# Altium project Twintig-Tap-Pads.PrjPcb
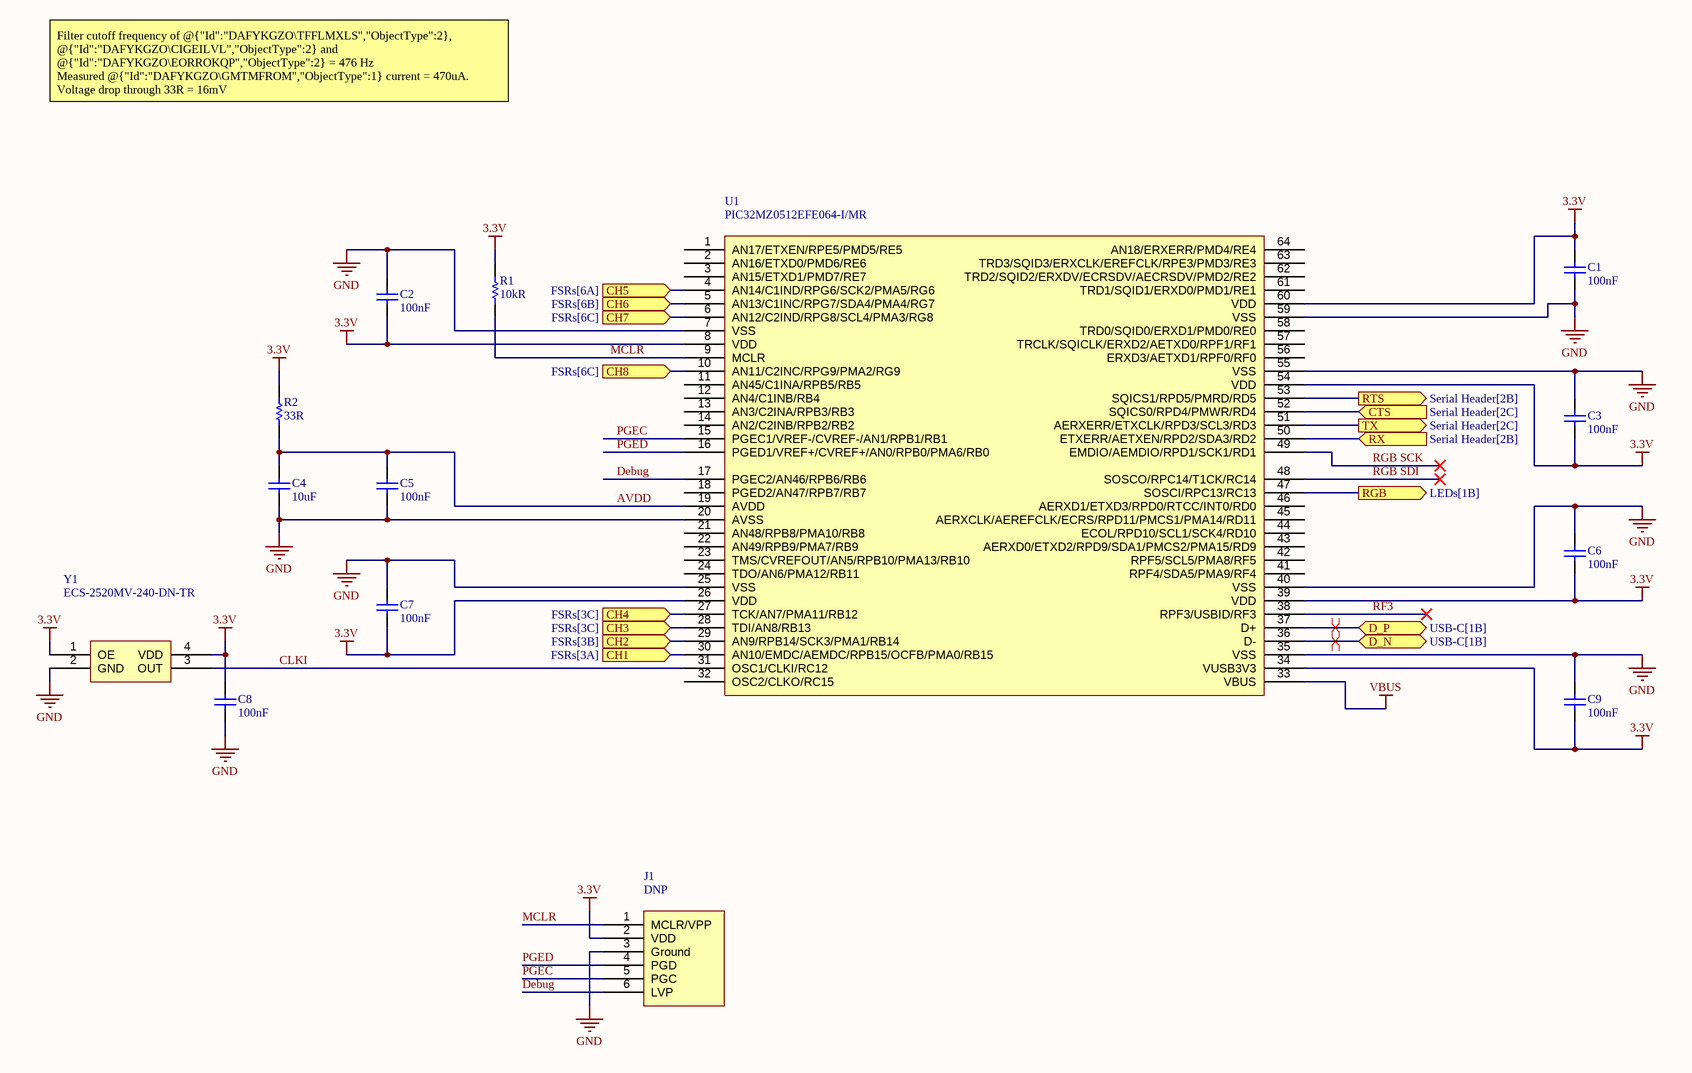
[diagram p0: PIC32MZ.SchDoc]
Version: v1.0.1; Project: Twintig Tap Pads; Author: Seb Madgwick
6 sheets, 70 parts. Net scope: flat (ports and power ports of the same name join across sheets).
Board file: Twintig-Tap-Pads.PcbDoc
Sheets:
  PIC32MZ.SchDoc
  USB-C.SchDoc
  Serial Header.SchDoc
  Voltage Regulator.SchDoc
  FSRs.SchDoc
  LEDs.SchDoc

## Sheet PIC32MZ.SchDoc
size A3; SheetNumber: 1; SheetTotal: 6

### Parts
C1  100nF  [Capacitor 0402]
C2  100nF  [Capacitor 0402]
C3  100nF  [Capacitor 0402]
C4  10uF  [Capacitor 0402]
C5  100nF  [Capacitor 0402]
C6  100nF  [Capacitor 0402]
C7  100nF  [Capacitor 0402]
C8  100nF  [Capacitor 0402]
C9  100nF  [Capacitor 0402]
J1  DNP  [Tag Connect No Legs]
R1  10kR  [Resistor 0402]
R2  33R  [Resistor 0402]
U1  PIC32MZ0512EFE064-I/MR  [QFN-64]
Y1  ECS-2520MV-240-DN-TR  [ECS 2x2.5mm]

### Ports
CH1 (in, see FSRs[3A]), CH2 (in, see FSRs[3B]), CH3 (in, see FSRs[3C]), CH4 (in, see FSRs[3C]), CH5 (in, see FSRs[6A]), CH6 (in, see FSRs[6B]), CH7 (in, see FSRs[6C]), CH8 (in, see FSRs[6C]), CTS (in, see Serial Header[2C]), D_N (bidir, see USB-C[1B]), D_P (bidir, see USB-C[1B]), RGB (out, see LEDs[1B]), RTS (out, see Serial Header[2B]), RX (in, see Serial Header[2B]), TX (out, see Serial Header[2C])

### Nets
3.3V: C1.2 C2.1 C3.1 C6.1 C7.1 C8.2 C9.1 J1.2(VDD) R1.2 R2.2 U1.8(VDD) U1.26(VDD) U1.34(VUSB3V3) U1.39(VDD) U1.54(VDD) U1.60(VDD) Y1.1(OE) Y1.4(VDD)
GND: C1.1 C2.2 C3.2 C4.1 C5.1 C6.2 C7.2 C8.1 C9.2 J1.3(Ground) U1.7(VSS) U1.20(AVSS) U1.25(VSS) U1.35(VSS) U1.40(VSS) U1.55(VSS) U1.59(VSS) Y1.2(GND)
VBUS: U1.33(VBUS)
AVDD: C4.2 C5.2 R2.1 U1.19(AVDD)
CH1: U1.30(AN10/EMDC/AEMDC/RPB15/OCFB/PMA0/RB15) ; port CH1
CH2: U1.29(AN9/RPB14/SCK3/PMA1/RB14) ; port CH2
CH3: U1.28(TDI/AN8/RB13) ; port CH3
CH4: U1.27(TCK/AN7/PMA11/RB12) ; port CH4
CH5: U1.4(AN14/C1IND/RPG6/SCK2/PMA5/RG6) ; port CH5
CH6: U1.5(AN13/C1INC/RPG7/SDA4/PMA4/RG7) ; port CH6
CH7: U1.6(AN12/C2IND/RPG8/SCL4/PMA3/RG8) ; port CH7
CH8: U1.10(AN11/C2INC/RPG9/PMA2/RG9) ; port CH8
CLKI: U1.31(OSC1/CLKI/RC12) Y1.3(OUT)
CTS: U1.52(SQICS0/RPD4/PMWR/RD4) ; port CTS
D_N: U1.36(D-) ; port D_N
D_P: U1.37(D+) ; port D_P
Debug: J1.6(LVP) U1.17(PGEC2/AN46/RPB6/RB6)
MCLR: J1.1(MCLR/VPP) R1.1 U1.9(MCLR)
PGEC: J1.5(PGC) U1.15(PGEC1/VREF-/CVREF-/AN1/RPB1/RB1)
PGED: J1.4(PGD) U1.16(PGED1/VREF+/CVREF+/AN0/RPB0/PMA6/RB0)
RF3: U1.38(RPF3/USBID/RF3)
RGB: U1.47(SOSCI/RPC13/RC13) ; port RGB
RGB SCK: U1.49(EMDIO/AEMDIO/RPD1/SCK1/RD1)
RGB SDI: U1.48(SOSCO/RPC14/T1CK/RC14)
RTS: U1.53(SQICS1/RPD5/PMRD/RD5) ; port RTS
RX: U1.50(ETXERR/AETXEN/RPD2/SDA3/RD2) ; port RX
TX: U1.51(AERXERR/ETXCLK/RPD3/SCL3/RD3) ; port TX

Not connected (* = marked no-connect by the designer): U1 1(AN17/ETXEN/RPE5/PMD5/RE5) 2(AN16/ETXD0/PMD6/RE6) 3(AN15/ETXD1/PMD7/RE7) 11(AN45/C1INA/RPB5/RB5) 12(AN4/C1INB/RB4) 13(AN3/C2INA/RPB3/RB3) 14(AN2/C2INB/RPB2/RB2) 18(PGED2/AN47/RPB7/RB7) 21(AN48/RPB8/PMA10/RB8) 22(AN49/RPB9/PMA7/RB9) 23(TMS/CVREFOUT/AN5/RPB10/PMA13/RB10) 24(TDO/AN6/PMA12/RB11) 32(OSC2/CLKO/RC15) 41(RPF4/SDA5/PMA9/RF4) 42(RPF5/SCL5/PMA8/RF5) 43(AERXD0/ETXD2/RPD9/SDA1/PMCS2/PMA15/RD9) 44(ECOL/RPD10/SCL1/SCK4/RD10) 45(AERXCLK/AEREFCLK/ECRS/RPD11/PMCS1/PMA14/RD11) 46(AERXD1/ETXD3/RPD0/RTCC/INT0/RD0) 56(ERXD3/AETXD1/RPF0/RF0) 57(TRCLK/SQICLK/ERXD2/AETXD0/RPF1/RF1) 58(TRD0/SQID0/ERXD1/PMD0/RE0) 61(TRD1/SQID1/ERXD0/PMD1/RE1) 62(TRD2/SQID2/ERXDV/ECRSDV/AECRSDV/PMD2/RE2) 63(TRD3/SQID3/ERXCLK/EREFCLK/RPE3/PMD3/RE3) 64(AN18/ERXERR/PMD4/RE4)

### Layout directives
differential pair: D_N, D_P

### Notes on the sheet
- Filter cutoff frequency of @{"Id":"DAFYKGZO\TFFLMXLS","ObjectType":2}, @{"Id":"DAFYKGZO\CIGEILVL","ObjectType":2} and @{"Id":"DAFYKGZO\EORROKQP","ObjectType":2} = 476 Hz
  Measured @{"Id":"DAFYKGZO\GMTMFROM","ObjectType":1} current = 470uA.  Voltage drop through 33R = 16mV
  @{"Id":"DAFYKGZO\FKAAGDIW","ObjectType":1} functionality may be compromised by USBID regardless of configuration.
  @{"Id":"DAFYKGZO\YGGPIFJJ","ObjectType":1} requires PIC32MZ internal pull-down to ensure @{"Id":"GGXARTPA\NNOJOWHS","ObjectType":1} is idle low.
  @{"Id":"DAFYKGZO\MQFSLGKT","ObjectType":1} will output SCK1 regardless of PPS configuration.
- TITLE
- SIZE
- A3
- VARIANT
- PROJECT
- SHEET
- VERSION
- OF
- AUTHOR
- DATE

### Library data of the parts
C1-C9 = Capacitor
J1 = MPLAB ICSP
R1 R2 = Resistor
U1 = PIC32MZ2048EFH064
Y1 = Oscillator

## Sheet USB-C.SchDoc
size A4; SheetNumber: 2; SheetTotal: 6
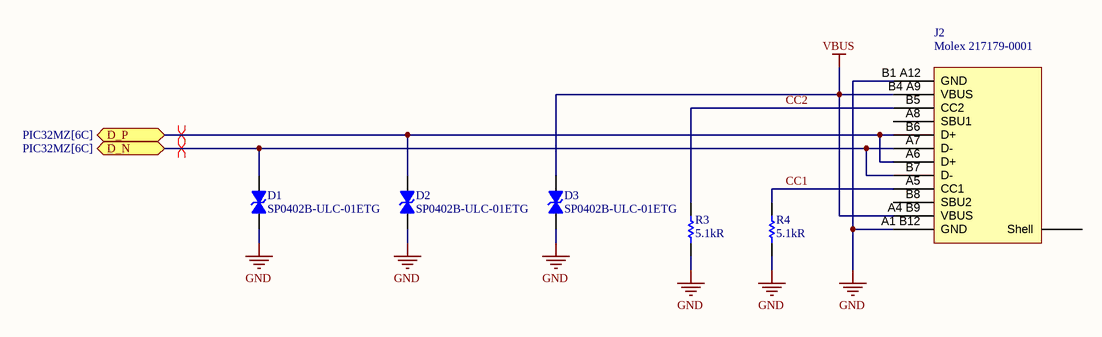
[diagram p1: USB-C.SchDoc]

### Parts
D1  SP0402B-ULC-01ETG  [Diode TVS 0402]
D2  SP0402B-ULC-01ETG  [Diode TVS 0402]
D3  SP0402B-ULC-01ETG  [Diode TVS 0402]
J2  Molex 217179-0001  [Molex 217179-0001]
R3  5.1kR  [Resistor 0402]
R4  5.1kR  [Resistor 0402]

### Ports
D_N (bidir, see PIC32MZ[6C]), D_P (bidir, see PIC32MZ[6C])

### Nets
GND: D1.2 D2.2 D3.2 J2.A1_B12(GND) J2.B1_A12(GND) R3.1 R4.1
VBUS: D3.1 J2.A4_B9(VBUS) J2.B4_A9(VBUS)
CC1: J2.A5(CC1) R4.2
CC2: J2.B5(CC2) R3.2
D_N: D1.1 J2.A7(D-) J2.B7(D-) ; port D_N
D_P: D2.1 J2.A6(D+) J2.B6(D+) ; port D_P

Not connected (* = marked no-connect by the designer): J2 A8(SBU1) B8(SBU2) Shell

### Layout directives
differential pair: D_N, D_P

### Notes on the sheet
- TITLE
- SIZE
- A4
- VARIANT
- PROJECT
- SHEET
- VERSION
- OF
- AUTHOR
- DATE

### Library data of the parts
D1-D3 = Diode TVS
J2 = USB-C Receptacle (16 Pin)
R3 R4 = Resistor

## Sheet Serial Header.SchDoc
size A4; SheetNumber: 3; SheetTotal: 6
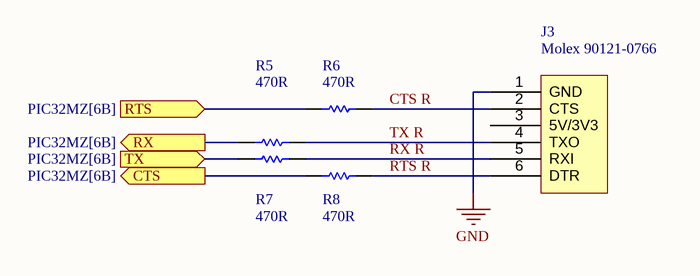
[diagram p2: Serial Header.SchDoc]

### Parts
J3  Molex 90121-0766  [Molex 90120-0926]
R5  470R  [Resistor 0402]
R6  470R  [Resistor 0402]
R7  470R  [Resistor 0402]
R8  470R  [Resistor 0402]

### Ports
CTS (out, see PIC32MZ[6B]), RTS (in, see PIC32MZ[6B]), RX (out, see PIC32MZ[6B]), TX (in, see PIC32MZ[6B])

### Nets
GND: J3.1(GND)
CTS: R8.2 ; port CTS
CTS R: J3.2(CTS) R6.1
RTS: R6.2 ; port RTS
RTS R: J3.6(DTR) R8.1
RX: R5.2 ; port RX
RX R: J3.5(RXI) R7.1
TX: R7.2 ; port TX
TX R: J3.4(TXO) R5.1

Not connected (* = marked no-connect by the designer): J3 3(5V/3V3)

### Notes on the sheet
- TITLE
- SIZE
- A4
- VARIANT
- PROJECT
- SHEET
- VERSION
- OF
- AUTHOR
- DATE

### Library data of the parts
J3 = FTDI Breakout
R5-R8 = Resistor

## Sheet Voltage Regulator.SchDoc
size A4; SheetNumber: 4; SheetTotal: 6
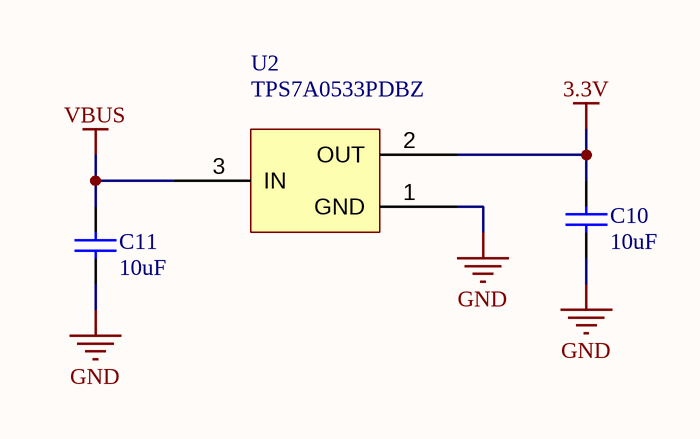
[diagram p3: Voltage Regulator.SchDoc]

### Parts
C10  10uF  [Capacitor 0402]
C11  10uF  [Capacitor 0402]
U2  TPS7A0533PDBZ  [SOT-23]

### Nets
3.3V: C10.2 U2.2(OUT)
GND: C10.1 C11.1 U2.1(GND)
VBUS: C11.2 U2.3(IN)

### Notes on the sheet
- TITLE
- SIZE
- A4
- VARIANT
- PROJECT
- SHEET
- VERSION
- OF
- AUTHOR
- DATE

### Library data of the parts
C10 C11 = Capacitor

## Sheet FSRs.SchDoc
size A3; SheetNumber: 5; SheetTotal: 6
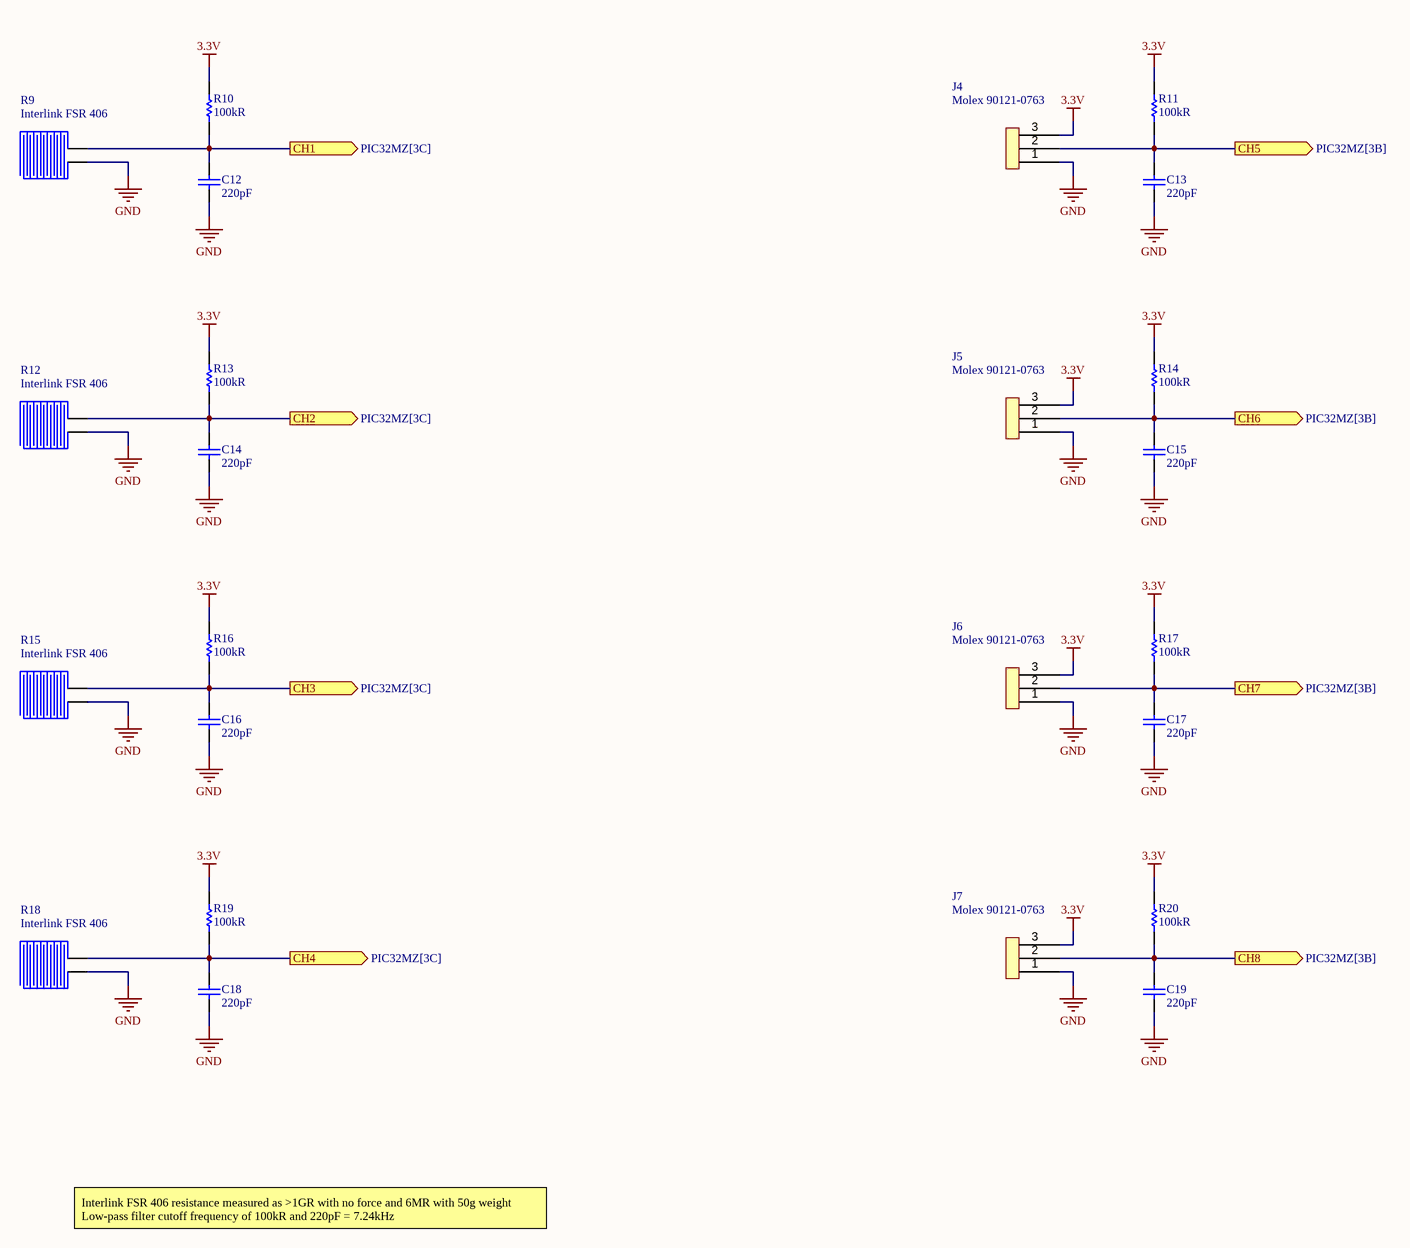
[diagram p4: FSRs.SchDoc]

### Parts
C12  220pF  [Capacitor 0402]
C13  220pF  [Capacitor 0402]
C14  220pF  [Capacitor 0402]
C15  220pF  [Capacitor 0402]
C16  220pF  [Capacitor 0402]
C17  220pF  [Capacitor 0402]
C18  220pF  [Capacitor 0402]
C19  220pF  [Capacitor 0402]
J4  Molex 90121-0763  [Molex 90121-0763]
J5  Molex 90121-0763  [Molex 90121-0763]
J6  Molex 90121-0763  [Molex 90121-0763]
J7  Molex 90121-0763  [Molex 90121-0763]
R9  Interlink FSR 406  [Interlink FSR 406]
R10  100kR  [Resistor 0402]
R11  100kR  [Resistor 0402]
R12  Interlink FSR 406  [Interlink FSR 406]
R13  100kR  [Resistor 0402]
R14  100kR  [Resistor 0402]
R15  Interlink FSR 406  [Interlink FSR 406]
R16  100kR  [Resistor 0402]
R17  100kR  [Resistor 0402]
R18  Interlink FSR 406  [Interlink FSR 406]
R19  100kR  [Resistor 0402]
R20  100kR  [Resistor 0402]

### Ports
CH1 (out, see PIC32MZ[3C]), CH2 (out, see PIC32MZ[3C]), CH3 (out, see PIC32MZ[3C]), CH4 (out, see PIC32MZ[3C]), CH5 (out, see PIC32MZ[3B]), CH6 (out, see PIC32MZ[3B]), CH7 (out, see PIC32MZ[3B]), CH8 (out, see PIC32MZ[3B])

### Nets
3.3V: J4.3 J5.3 J6.3 J7.3 R10.2 R11.2 R13.2 R14.2 R16.2 R17.2 R19.2 R20.2
GND: C12.1 C13.1 C14.1 C15.1 C16.1 C17.1 C18.1 C19.1 J4.1 J5.1 J6.1 J7.1 R9.2 R12.2 R15.2 R18.2
CH1: C12.2 R9.1 R10.1 ; port CH1
CH2: C14.2 R12.1 R13.1 ; port CH2
CH3: C16.2 R15.1 R16.1 ; port CH3
CH4: C18.2 R18.1 R19.1 ; port CH4
CH5: C13.2 J4.2 R11.1 ; port CH5
CH6: C15.2 J5.2 R14.1 ; port CH6
CH7: C17.2 J6.2 R17.1 ; port CH7
CH8: C19.2 J7.2 R20.1 ; port CH8

### Notes on the sheet
- Interlink FSR 406 resistance measured as >1GR with no force and 6MR with 50g weight
  Low-pass filter cutoff frequency of 100kR and 220pF = 7.24kHz
- TITLE
- SIZE
- A3
- VARIANT
- PROJECT
- SHEET
- VERSION
- OF
- AUTHOR
- DATE

### Library data of the parts
C12-C19 = Capacitor
R10 R11 R13 R14 R16 R17 R19 R20 = Resistor

## Sheet LEDs.SchDoc
size A3; SheetNumber: 6; SheetTotal: 6
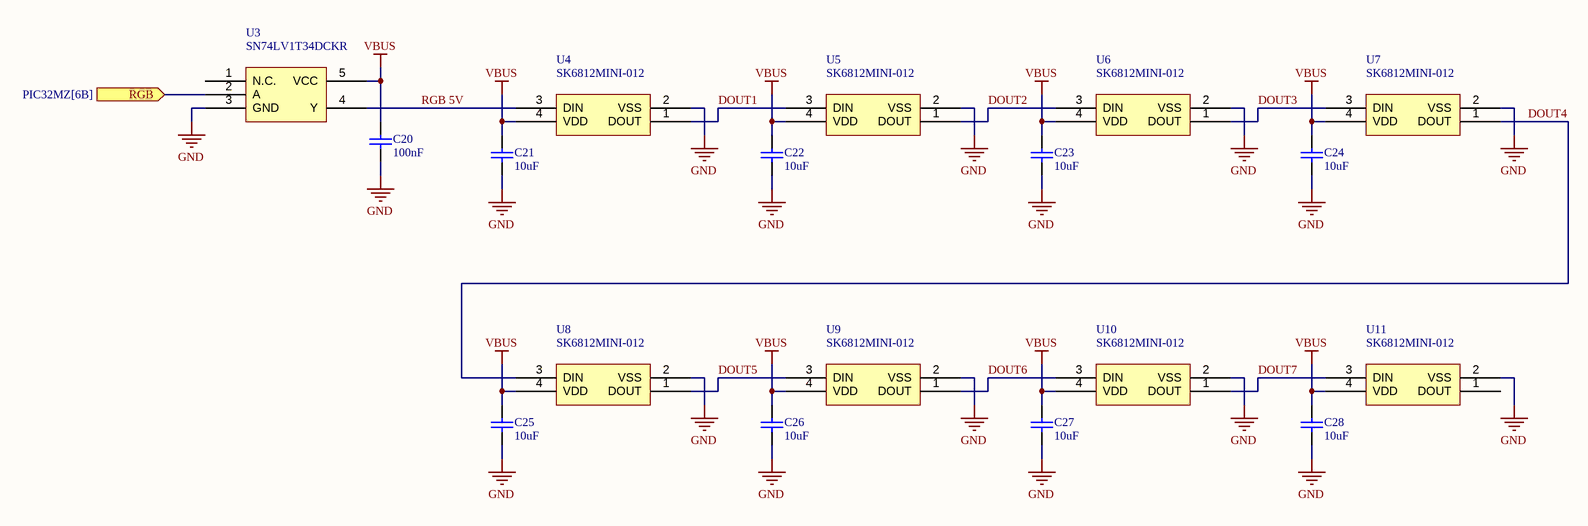
[diagram p5: LEDs.SchDoc]

### Parts
C20  100nF  [Capacitor 0402]
C21  10uF  [Capacitor 0603]
C22  10uF  [Capacitor 0603]
C23  10uF  [Capacitor 0603]
C24  10uF  [Capacitor 0603]
C25  10uF  [Capacitor 0603]
C26  10uF  [Capacitor 0603]
C27  10uF  [Capacitor 0603]
C28  10uF  [Capacitor 0603]
U3  SN74LV1T34DCKR  [SOT-323-5]
U4  SK6812MINI-012  [SK6812MINI-B-012]
U5  SK6812MINI-012  [SK6812MINI-B-012]
U6  SK6812MINI-012  [SK6812MINI-B-012]
U7  SK6812MINI-012  [SK6812MINI-B-012]
U8  SK6812MINI-012  [SK6812MINI-B-012]
U9  SK6812MINI-012  [SK6812MINI-B-012]
U10  SK6812MINI-012  [SK6812MINI-B-012]
U11  SK6812MINI-012  [SK6812MINI-B-012]

### Ports
RGB (in, see PIC32MZ[6B])

### Nets
GND: C20.1 C21.1 C22.1 C23.1 C24.1 C25.1 C26.1 C27.1 C28.1 U3.3(GND) U4.2(VSS) U5.2(VSS) U6.2(VSS) U7.2(VSS) U8.2(VSS) U9.2(VSS) U10.2(VSS) U11.2(VSS)
VBUS: C20.2 C21.2 C22.2 C23.2 C24.2 C25.2 C26.2 C27.2 C28.2 U3.5(VCC) U4.4(VDD) U5.4(VDD) U6.4(VDD) U7.4(VDD) U8.4(VDD) U9.4(VDD) U10.4(VDD) U11.4(VDD)
DOUT1: U4.1(DOUT) U5.3(DIN)
DOUT2: U5.1(DOUT) U6.3(DIN)
DOUT3: U6.1(DOUT) U7.3(DIN)
DOUT4: U7.1(DOUT) U8.3(DIN)
DOUT5: U8.1(DOUT) U9.3(DIN)
DOUT6: U9.1(DOUT) U10.3(DIN)
DOUT7: U10.1(DOUT) U11.3(DIN)
RGB: U3.2(A) ; port RGB
RGB 5V: U3.4(Y) U4.3(DIN)

Not connected (* = marked no-connect by the designer): U3 1(N.C.); U11 1(DOUT)

### Notes on the sheet
- TITLE
- SIZE
- A3
- VARIANT
- PROJECT
- SHEET
- VERSION
- OF
- AUTHOR
- DATE

### Library data of the parts
C20-C28 = Capacitor
U3 = SN74LVC1xxx (1 Input)
U4-U11 = SK6812MINI-B-012

## Nets that join several sheets
3.3V: PIC32MZ (18 pins), Voltage Regulator (C10.2 U2.2), FSRs (12 pins)
GND: PIC32MZ (18 pins), USB-C (7 pins), Serial Header (J3.1), Voltage Regulator (C10.1 C11.1 U2.1), FSRs (16 pins), LEDs (18 pins)
VBUS: PIC32MZ (U1.33), USB-C (D3.1 J2.A4 B9 J2.B4 A9), Voltage Regulator (C11.2 U2.3), LEDs (18 pins)
CH1: PIC32MZ (U1.30), FSRs (C12.2 R9.1 R10.1)
CH2: PIC32MZ (U1.29), FSRs (C14.2 R12.1 R13.1)
CH3: PIC32MZ (U1.28), FSRs (C16.2 R15.1 R16.1)
CH4: PIC32MZ (U1.27), FSRs (C18.2 R18.1 R19.1)
CH5: PIC32MZ (U1.4), FSRs (C13.2 J4.2 R11.1)
CH6: PIC32MZ (U1.5), FSRs (C15.2 J5.2 R14.1)
CH7: PIC32MZ (U1.6), FSRs (C17.2 J6.2 R17.1)
CH8: PIC32MZ (U1.10), FSRs (C19.2 J7.2 R20.1)
CTS: PIC32MZ (U1.52), Serial Header (R8.2)
D_N: PIC32MZ (U1.36), USB-C (D1.1 J2.A7 J2.B7)
D_P: PIC32MZ (U1.37), USB-C (D2.1 J2.A6 J2.B6)
RGB: PIC32MZ (U1.47), LEDs (U3.2)
RTS: PIC32MZ (U1.53), Serial Header (R6.2)
RX: PIC32MZ (U1.50), Serial Header (R5.2)
TX: PIC32MZ (U1.51), Serial Header (R7.2)